# Altium schematic sheet microcontrolador.SchDoc
size A4
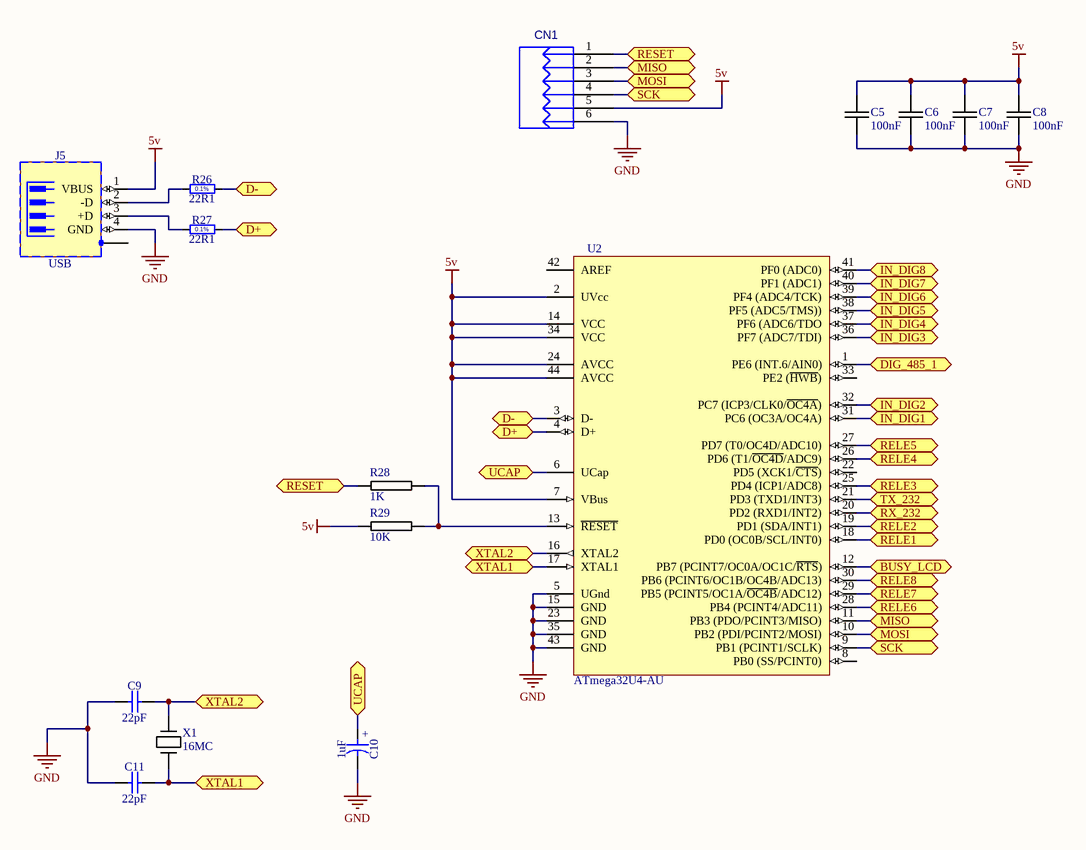
[diagram p0: microcontrolador.SchDoc]

## Parts
C5  100nF  [0805C-TBD]
C6  100nF  [0805C-TBD]
C7  100nF  [0805C-TBD]
C8  100nF  [0805C-TBD]
C9  22pF  [CAPC2012X135N]
C10  1uF  [CAPPRB254-450X710]
C11  22pF  [CAPC2012X135N]
CN1  CONECTOR 2,5 - 6VIAS AMP 880222-6  [CONECTOR 2.5 - 6 VIAS AMP 880222-6]  (value not drawn)
J5  USB  [TYCO_292304-1]
R26  22R1  [RESC2012X60N]
R27  22R1  [RESC2012X60N]
R28  1K  [0805R-1K]
R29  10K  [0805R-10K]
U2  ATmega32U4-AU  [44ML_N]
X1  16MC  [XTAL-RU49/4]

## Ports
BUSY_LCD, D+, D-, DIG_485_1 (bidir), IN_DIG1, IN_DIG2, IN_DIG3, IN_DIG4, IN_DIG5, IN_DIG6, IN_DIG7, IN_DIG8, MISO, MOSI, RELE1, RELE2, RELE3, RELE4, RELE5, RELE6, RELE7, RELE8, RESET, RX_232, SCK, TX_232, UCAP, XTAL1, XTAL2

## Nets
5v: C5.2 C6.2 C7.2 C8.2 CN1.5 J5.1(VBUS) R29.1 U2.2(UVcc) U2.7(VBus) U2.14(VCC) U2.24(AVCC) U2.34(VCC) U2.44(AVCC)
GND: C5.1 C6.1 C7.1 C8.1 C9.1 C10.2 C11.1 CN1.6 J5.4(GND) U2.5(UGnd) U2.15(GND) U2.23(GND) U2.35(GND) U2.43(GND)
BUSY_LCD: U2.12(PB7_(PCINT7/OC0A/OC1C/~{RTS})) ; port BUSY_LCD
D+: R27.2 U2.4(D+) ; port D+
D-: R26.2 U2.3(D-) ; port D-
DIG_485_1: U2.1(PE6_(INT.6/AIN0)) ; port DIG_485_1
IN_DIG1: U2.31(PC6_(OC3A/OC4A)) ; port IN_DIG1
IN_DIG2: U2.32(PC7_(ICP3/CLK0/~{OC4A})) ; port IN_DIG2
IN_DIG3: U2.36(PF7_(ADC7/TDI)) ; port IN_DIG3
IN_DIG4: U2.37(PF6_(ADC6/TDO) ; port IN_DIG4
IN_DIG5: U2.38(PF5_(ADC5/TMS))) ; port IN_DIG5
IN_DIG6: U2.39(PF4_(ADC4/TCK)) ; port IN_DIG6
IN_DIG7: U2.40(PF1_(ADC1)) ; port IN_DIG7
IN_DIG8: U2.41(PF0_(ADC0)) ; port IN_DIG8
MISO: CN1.2 U2.11(PB3_(PDO/PCINT3/MISO)) ; port MISO
MOSI: CN1.3 U2.10(PB2_(PDI/PCINT2/MOSI)) ; port MOSI
RELE1: U2.18(PD0_(OC0B/SCL/INT0)) ; port RELE1
RELE2: U2.19(PD1_(SDA/INT1)) ; port RELE2
RELE3: U2.25(PD4_(ICP1/ADC8)) ; port RELE3
RELE4: U2.26(PD6_(T1/~{OC4D}/ADC9)) ; port RELE4
RELE5: U2.27(PD7_(T0/OC4D/ADC10)) ; port RELE5
RELE6: U2.28(PB4_(PCINT4/ADC11)) ; port RELE6
RELE7: U2.29(PB5_(PCINT5/OC1A/~{OC4B}/ADC12)) ; port RELE7
RELE8: U2.30(PB6_(PCINT6/OC1B/OC4B/ADC13)) ; port RELE8
RESET: CN1.1 R28.1 ; port RESET
RX_232: U2.20(PD2_(RXD1/INT2)) ; port RX_232
SCK: CN1.4 U2.9(PB1_(PCINT1/SCLK)) ; port SCK
TX_232: U2.21(PD3_(TXD1/INT3)) ; port TX_232
UCAP: C10.1 U2.6(UCap) ; port UCAP
XTAL1: C11.2 U2.17(XTAL1) X1.2 ; port XTAL1
XTAL2: C9.2 U2.16(XTAL2) X1.1 ; port XTAL2
NetJ5_2: J5.2(-D) R26.1
NetJ5_3: J5.3(+D) R27.1
NetR28_2: R28.2 R29.2 U2.13(~{RESET})

Not connected (* = marked no-connect by the designer): J5 5(SHIELD); U2 8(PB0_(SS/PCINT0)) 22(PD5_(XCK1/~{CTS})) 33(PE2_(~{HWB})) 42(AREF)

## Notes on the sheet
- (in symbol CTEB_1UF_35V_10%_254-450X710) +
- (in symbol R0805_22R1_0.1%_0.1W_10PPM) 0.1%

## Library data of the parts
C5-C8 = 0805C-100nF-25V-X7R-MUR: CAPACITOR 0805 CERAMIC; Supplier 1: Digi-Key; Supplier Part Number 1: 490-1673-1-ND
C9 C11 = CC0805_22PF_50V_5%_NP0: Non-polarised capacitor; Part Description: SMD Multilayer Chip Ceramic Capacitor; Manufacturer: GENERIC; Manufacturer1 Part Number: 223886115229; Voltage: 50V; TC: NP0; Tolerance: ±5%; Table: Capacitors SMD; Part Number: CC0805_22PF_50V_5%_NP0; Component Kind: Standard; Component Type: Standard; Pin Count: 2; Value: 22pF; Status: Preferred; Manufacturer Part Number: CC0805_22PF_50V_5%_NP0; Case: 0805; Mounted: Yes; Socket: No; SMD: Yes; Manufacturer1 Example: PHYCOMP; Manufacturer1 ComponentHeight: 1.35mm; HelpURL: \\cern.ch\dfs\Applications\Altium\Datasheets\CC0805_NP0_PHYCOMP.pdf; Author: CERN DEM JLC; CreateDate: 03/12/2007; LatestRevisionDate: 03/12/2007
C10 = CTEB_1UF_35V_10%_254-450X710: Polarised capacitor; Part Description: Solid Tantalum Resin Dipped Capacitor; Manufacturer: KEMET; Manufacturer Part Number: T350A105K035AT; Voltage: 35V; Tolerance: ±10%; Table: Capacitors THD; Part Number: CTEB_1UF_35V_10%_254-450X710; Component Kind: Standard; Component Type: Standard; Pin Count: 2; Value: 1uF; Status: None; Case: LS2.54 D4.5 x H7.1; Mounted: Yes; Socket: No; SMD: No; ComponentHeight: 7.1mm; HelpURL: \\cern.ch\dfs\Applications\Altium\Datasheets\CTEB_KEMET_T350.pdf; Author: CERN DEM JLC; CreateDate: 16/12/2009; LatestRevisionDate: 16/12/2009
CN1 = CONECTOR 2,5 - 6VIAS AMP 880222-6: cod: 302003185; 3D comp: CONECTOR 2,5 - 6VIAS AMP 880222-6; Compra: 302003185; Descri: CONECTOR 2,5 - 6VIAS AMP 880222-6; SCH: CONECTOR 2,5 - 6VIAS AMP 880222-6
J5 = TYCO_292304-1: 4 Pin + 1 Shield USB Receptacle; Part Description: Thru Hole, Right Angle, 4 Position, Type B, USB Receptacle; Manufacturer: TYCO ELECTRONICS; Table: TYCO; Part Number: TYCO_292304-1; Component Kind: Standard; Component Type: Standard; Pin Count: 5; Family: USB; Mounted: Yes; Socket: No; SMD: No; Status: None; Manufacturer Part Number: 292304-1; ComponentHeight: 11.5mm; HelpURL: \\cern.ch\dfs\Applications\Altium\Datasheets\TYCO_292304-1.pdf; Author: CERN DEM JLC; CreateDate: 16/07/2010; LatestRevisionDate: 16/07/2010
R26 R27 = R0805_22R1_0.1%_0.1W_10PPM: Resistor - 0.1%; Part Description: Thin Film Chip Resistor; Manufacturer: GENERIC; Manufacturer1 Part Number: RN73C2A22R1BTG; Power: 0.1W; TC: ±10ppm; Table: Resistors SMD; Part Number: R0805_22R1_0.1%_0.1W_10PPM; Component Kind: Standard; Component Type: Standard; Pin Count: 2; Value: 22R1; Status: Not recommended; Tolerance: ±0.1%; Manufacturer Part Number: R0805_22R1_0.1%_0.1W_10PPM; Case: 0805; Mounted: Yes; Socket: No; SMD: Yes; Manufacturer1 Example: TYCO HOLSWORTHY; Manufacturer1 ComponentHeight: 0.6mm; HelpURL: \\cern.ch\dfs\Applications\Altium\Datasheets\R0805_Tyco_RN73.pdf; Author: CERN DEM JLC; CreateDate: 03/12/2007; LatestRevisionDate: 13/03/2008
R28 = 0805R-1K: RESISTOR 0805 1/4 WATT THIN FILM; Reel: *
R29 = 0805R-10K: RESISTOR 0805 1/4 WATT THIN FILM; Reel: *
U2 = ATmega32U4-AU: 8-bit AVR Microcontroller, 2.7-5.5V, 16MHz, 32KB Flash, 1KB EEPROM, 2.5KB SRAM, USB Controller, 44-pin TQFP, Industrial Grade (-40°C to 85°C), Ext Osc; DatasheetVersion: revF, Nov-2010; PackageVersion: rev.G, Jul-2007; PackageReference: 44ML; PackageDescription: 44-Pin Plastic Thin Quad Flat Pack, 10 x 10 x 1.0 mm Body, 0.8 mm Pitch (TQFP); ComponentLink1Description: Manufacturer URL; ComponentLink1URL: http://www.atmel.com/; ComponentLink2Description: ATmega16U4/32U4 Datasheet; ComponentLink2URL: http://www.atmel.com/dyn/resources/prod_documents/doc7766.pdf; ComponentLink3Description: ATmega16U4 ATmega32U4 Summary; ComponentLink3URL: http://www.atmel.com/dyn/resources/prod_documents/7766S.pdf
X1 = 16MC-HC49US: 16MHZ CRSYTAL HC49US; Supplier 1: Mouser; Supplier Part Number 1: 815-ABLS-16.0M-T